# Altium project BlackBox-LORA.PrjPcb
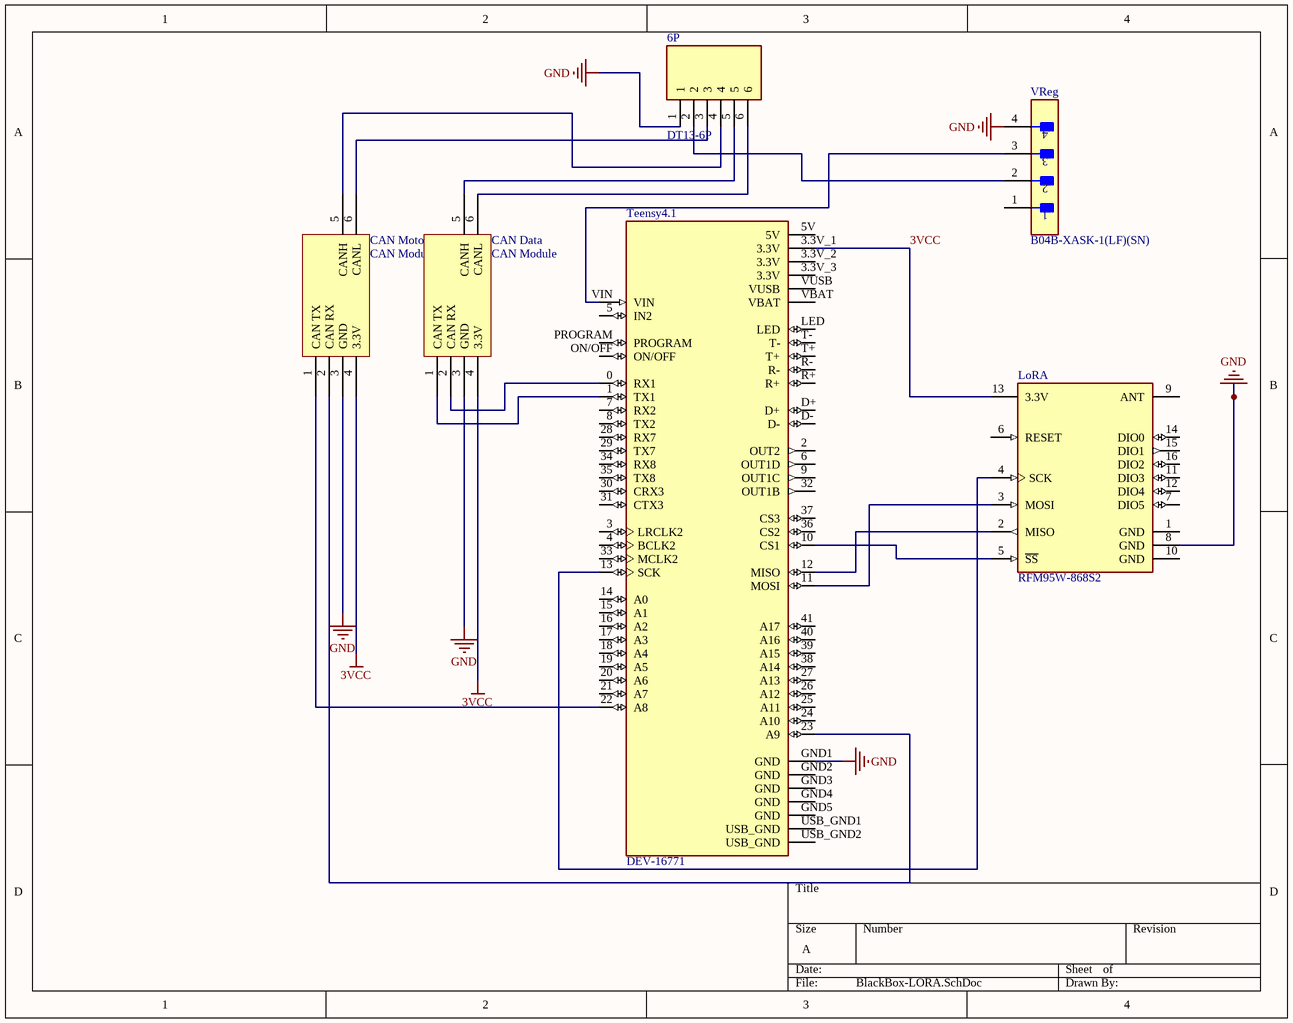
[diagram p0: BlackBox-LORA.SchDoc]
1 sheet, 6 parts. Net scope: global (net labels, ports and power ports of the same name join across sheets).
Board file: BlackBox-LORA.PcbDoc

## Sheet BlackBox-LORA.SchDoc
size A; SheetNumber: 1; SheetTotal: 1

### Parts
6P  DT13-6P  [TE_DT13-6P]
CAN_Data  CAN Module  [CAN Module-Footprint-1]
CAN_Motor  CAN Module  [CAN Module-Footprint-1]
LoRA  RFM95W-868S2  [FP-RFM95W-868S2-MFG]
Teensy4.1  DEV-16771  [MODULE_DEV-16771]
VReg  B04B-XASK-1(LF)(SN)  [FP-B04B-XASK-1_LF_SN-MFG]

### Nets
3VCC: CAN_Data.4(3.3V) CAN_Motor.4(3.3V) LoRA.13(3.3V) Teensy4.1.3.3V_1(3.3V)
GND: 6P.1 CAN_Data.3(GND) CAN_Motor.3(GND) LoRA.8(GND) Teensy4.1.GND1(GND) VReg.4
Net6P_2: 6P.2 VReg.2
Net6P_3: 6P.3 CAN_Motor.6(CANL)
Net6P_4: 6P.4 CAN_Motor.5(CANH)
Net6P_5: 6P.5 CAN_Data.5(CANH)
Net6P_6: 6P.6 CAN_Data.6(CANL)
NetCAN_Data_1: CAN_Data.1(CAN_TX) Teensy4.1.1(TX1)
NetCAN_Data_2: CAN_Data.2(CAN_RX) Teensy4.1.0(RX1)
NetCAN_Motor_1: CAN_Motor.1(CAN_TX) Teensy4.1.22(A8)
NetCAN_Motor_2: CAN_Motor.2(CAN_RX) Teensy4.1.23(A9)
NetLoRA_2: LoRA.2(MISO) Teensy4.1.12(MISO)
NetLoRA_3: LoRA.3(MOSI) Teensy4.1.11(MOSI)
NetLoRA_4: LoRA.4(SCK) Teensy4.1.13(SCK)
NetLoRA_5: LoRA.5(~{SS}) Teensy4.1.10(CS1)
NetTeensy4.1_VIN: Teensy4.1.VIN VReg.3

Not connected (* = marked no-connect by the designer): LoRA 1(GND) 6(RESET) 7(DIO5) 9(ANT) 10(GND) 11(DIO3) 12(DIO4) 14(DIO0) 15(DIO1) 16(DIO2); Teensy4.1 2(OUT2) 3(LRCLK2) 3.3V_2(3.3V) 3.3V_3(3.3V) 4(BCLK2) 5(IN2) 5V 6(OUT1D) 7(RX2) 8(TX2) 9(OUT1C) 14(A0) 15(A1) 16(A2) 17(A3) 18(A4) 19(A5) 20(A6) 21(A7) 24(A10) 25(A11) 26(A12) 27(A13) 28(RX7) 29(TX7) 30(CRX3) 31(CTX3) 32(OUT1B) 33(MCLK2) 34(RX8) 35(TX8) 36(CS2) 37(CS3) 38(A14) 39(A15) 40(A16) 41(A17) D+ D- GND2(GND) GND3(GND) GND4(GND) GND5(GND) LED ON/OFF PROGRAM R+ R- T+ T- USB_GND1(USB_GND) USB_GND2(USB_GND) VBAT VUSB; VReg 1

### Library data of the parts
6P = DT13-6P: DT13 Series, 4.44mm Pitch 6 Way 2 Row Right Angle PCB Header, Solder Termination; MF: TE Connectivity; DigiKey-Purchase-URL: https://snapeda.com/shop?store=DigiKey&id=1897474; Value: *; SnapEDA_Link: https://www.snapeda.com/parts/DT13-6P/TE%20Connectivity%20Deutsch%20Connectors/view-part/1897474/?ref=snap; EU_RoHS_Compliance: Compliant; Availability: Unavailable; Price: None; Package: None; MP: DT13-6P
CAN_Data CAN_Motor = CMP-00030-00003-1: CAN waveshare
LoRA = CMP-204316-000001-1: RX TXRX MODULE ISM < 1GHZ SMD; Data Rate: 300Kbps; Frequency: 868MHz; Sensitivity: -123dBm; Interface: SPI; Current - Transmitting: 120mA; Current - Receiving: 12.1mA; Max Operating Temperature: 70°C; Case/Package: SMD/SMT; Packaging: Bulk; Mount: Surface Mount; Min Operating Temperature: -20°C
Teensy4.1 = DEV-16771: RT1062 Teensy 4.1 series ARM® Cortex®-M7 MPU Embedded Evaluation Board; MF: SparkFun Electronics; SnapEDA_Link: https://www.snapeda.com/parts/DEV-16771/SparkFun+Electronics/view-part/?ref=snap; Package: None; Value: *; MP: DEV-16771; Check_prices: https://www.snapeda.com/parts/DEV-16771/SparkFun+Electronics/view-part/?ref=eda
VReg = CMP-17439-000018-1: CONN HEADER VERT 4POS 2.5MM; Manufacturer: JST; Current Rating: 3A; Voltage Rating: 250V; Conn Orientation: Straight; Conn Gender: Male; Number Of Contacts: 4; ComponentLink2Description: Datasheet; Package: B04B-XASK-1(LF)(SN); Octopart: https://octopart.com/b04b-xask-1%28lf%29%28sn%29-jst-3990149; Pitch: 2.5mm; Device Class L1: Connectors; RoHS: TRUE; Device Class L3: unset; Manufacturer Part Number: B04B-XASK-1(LF)(SN); Temperature Range High: +85°C; Height: 8.8mm; Lead Free: Yes; Category: Conn; Temperature: -25°C to +85°C; Digikey Description: CONN HEADER VERT 4POS 2.5MM; Temperature Range Low: -25°C; ComponentLink2URL: http://www.jst-mfg.com/product/pdf/eng/eXA1.pdf; Contact Material: Tin,Copper; Device Class L2: Headers and Wire Housings; Automotive: No; Number Of Rows: 1